# EasyEDA Pro project PCB_ExpansionModule_EXISTING_ERRORS.epro

# Schematic Schematic1
Create Date: 2024-09-10; Page Name: P1; Project Name: ESP32拓展板-硬设决赛; Schematic Name: Schematic1; Update Date: 2024-09-10; Company: THU EE; Drawed: Sxz; Page Size: A4; Version: V1.0
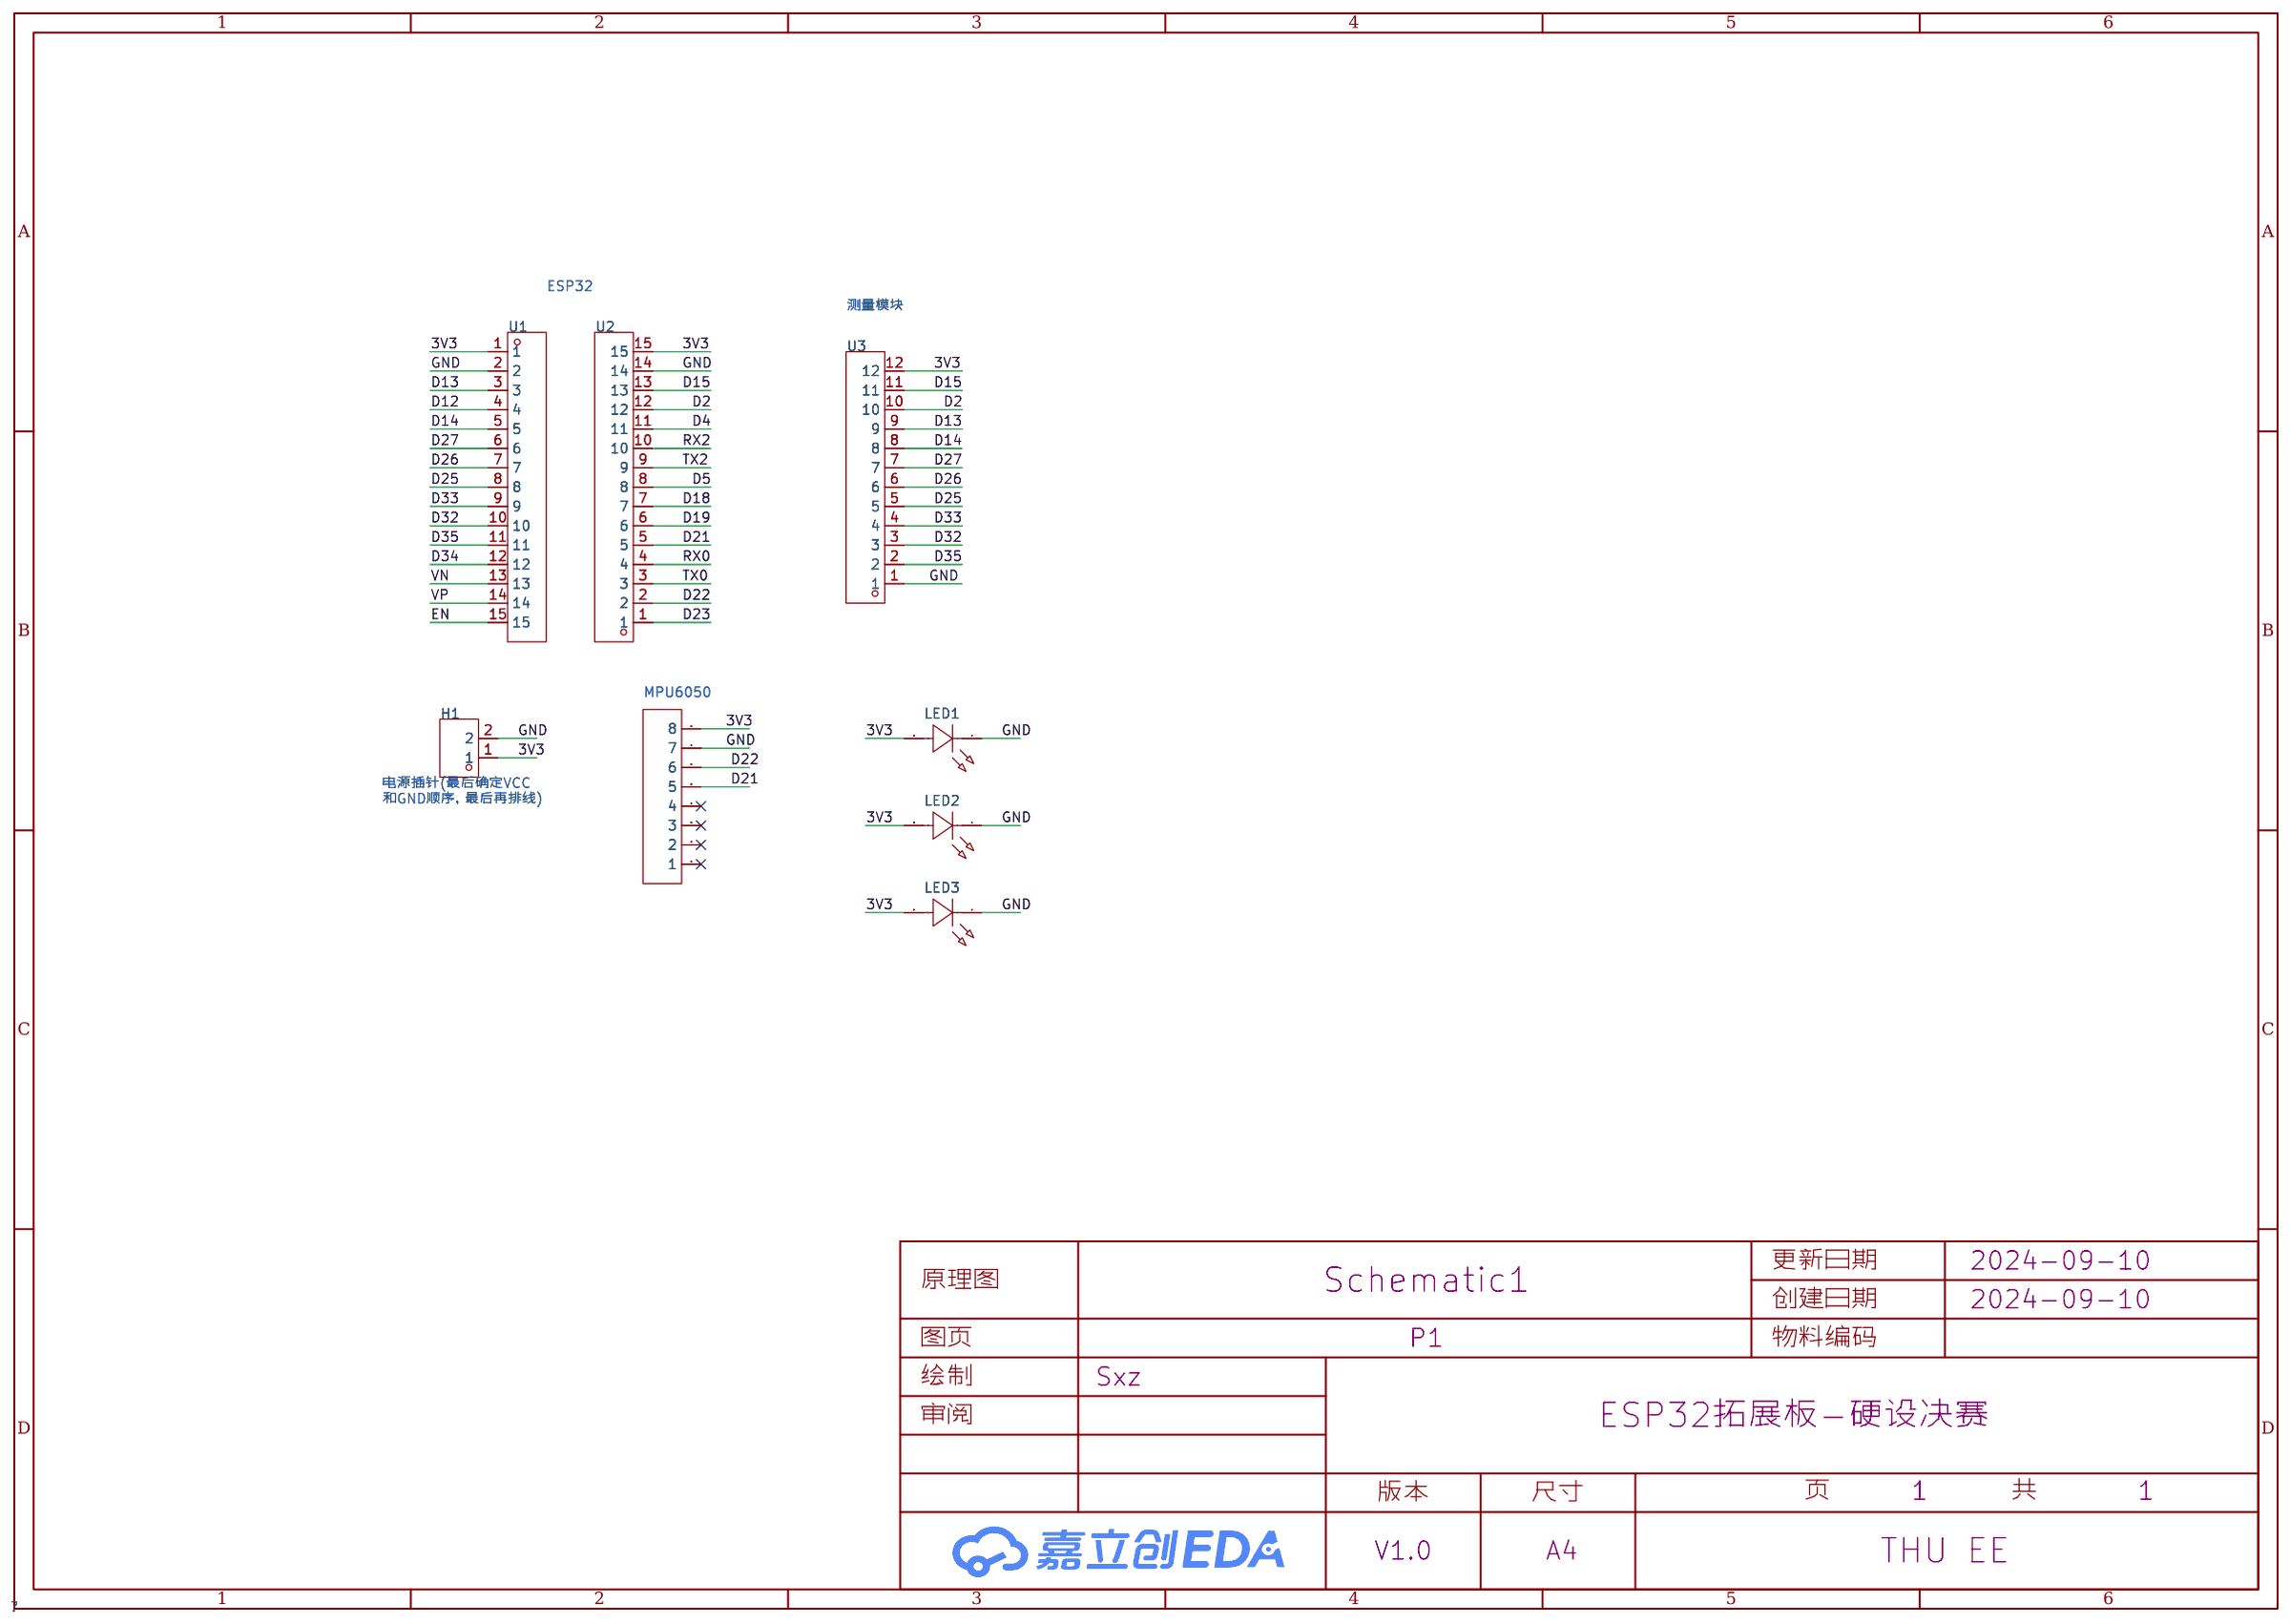
[diagram p0: schematic sheet]

## Parts
H1  -  [HDR-TH_2P-P2.54-H-M-W10.4]
LED1  XL-1608SURC-06  [LED0603-RD_RED]
LED2  XL-1608SURC-06  [LED0603-RD_RED]
LED3  XL-1608SURC-06  [LED0603-RD_RED]
P1  2.54-1*8P母环保  [HDR-TH_8P-P2.54-V-F-1]
U1  KH-2.54FH-1X15P-H8.5  [HDR-TH_15P-P2.54-V-F]
U2  KH-2.54FH-1X15P-H8.5  [HDR-TH_15P-P2.54-V-F]
U3  KH-2.54FH-1X12P-H8.5  [HDR-TH_12P-P2.54-V-F]

## Library data of the parts
H1 = PZ254R-11-02P: 插针结构:1x2P;间距:2.54mm;行距:-;圆针/方针:方针;安装类型:弯插;排数:单排;总PIN位数:2P;额定电流:-;额定电压:-;配合针长度:6mm;塑高:2.5mm;触头材质:黄铜;触头镀层:-;工作温度范围:-40℃~+105℃;颜色:黑色;; LCSC Part Name: 间距:2.54mm 1x2P 弯插 方针; Supplier Part: C492410; Manufacturer: XFCN(兴飞); Supplier Footprint: 弯插,P=2.54mm; JLCPCB Part Class: 扩展库; Datasheet: https://atta.szlcsc.com/upload/public/pdf/source/20200309/C492410_AD20A982E51A4870F6FD4D2413672598.pdf; Supplier: LCSC; Pin Structure: 1x2P; Pitch: 2.54mm; Circluar Pins/Square Pins: 方针; Mounting Type: 弯插; Number of Rows: 单排; Number of Pins: 2P; Length of Mating Pin: 6mm; Insulation Height: 2.5mm; Contact Material: 黄铜; Operating Temperature Range: -40℃~+105℃; Color: 黑色
LED1-LED3 = XL-1608SURC-06: 发光颜色:红色;功率:55mW;正向电流:25mA;主波长:617nm~621nm;透镜颜色:无色透明透镜;色温:-;发光角度:120°;载带方式:正贴;工作温度:-30℃~+85℃;; Supplier Part: C965799; Manufacturer: XINGLIGHT(成兴光); Supplier Footprint: 0603; Datasheet: https://atta.szlcsc.com/upload/public/pdf/source/20221102/D860AFDD1CDB02C5A8064103A32707E2.pdf; Supplier: LCSC; Emitted Color: 红色; Power Dissipation: 55mW; Forward Current: 25mA; Dominant Wavelength: 617nm~621nm; Peak Wavelength: 623nm; Lens Color: 无色透明透镜; Viewing Angle: 120°; Mounting Sytle: 正贴; Operating Temperature: -30℃~+85℃
P1 = 2.54-1*8P母环保: 插孔结构:1x8P;间距:2.54mm;行距:-;安装类型:直插;排数:单排;总孔位数:8P;塑高:-;触头材质:-;触头镀层:-;; LCSC Part Name: 间距:2.54mm 1x8P 直插; Supplier Part: C27438; Manufacturer: BOOMELE(博穆精密); Supplier Footprint: 插件,P=2.54mm; JLCPCB Part Class: 扩展库; Datasheet: https://atta.szlcsc.com/upload/public/pdf/source/20231221/1CA800C6799ED97958773716FAA1BFFE.pdf; Supplier: LCSC; Holes Structure: 1x8P; Pitch: 2.54mm; Mounting Type: 直插; Number of Rows: 单排; Number of Holes: 8P
U1 U2 = KH-2.54FH-1X15P-H8.5: 插孔结构:1x15P;间距:2.54mm;行距:-;圆孔/方孔:方孔;安装类型:直插;排数:单排;总孔位数:15P;额定电流:3A;额定电压:-;插孔方向:顶部;塑高:8.5mm;工作温度范围:-40℃~+105℃;; LCSC Part Name: 间距:2.54mm 1x15P 直插; Supplier Part: C2932676; Manufacturer: kinghelm(金航标); Supplier Footprint: 插件,P=2.54mm; JLCPCB Part Class: 扩展库; Datasheet: https://atta.szlcsc.com/upload/public/pdf/source/20211220/977AA415CFA981E866620A80068F25CA.pdf; Supplier: LCSC; Holes Structure: 1x15P; Pitch: 2.54mm; Circular Hole / Square Hole: 方孔; Mounting Type: 直插; Number of Rows: 单排; Number of Holes: 15P; Current Rating (Max): 3A; Holes Direction: 顶部; Insulation Height: 8.5mm; Operating Temperature Range: -40℃~+105℃
U3 = KH-2.54FH-1X12P-H8.5: 插孔结构:1x12P;间距:2.54mm;行距:-;圆孔/方孔:方孔;安装类型:直插;排数:单排;总孔位数:12P;额定电流:3A;额定电压:-;插孔方向:顶部;塑高:8.5mm;工作温度范围:-40℃~+105℃;; LCSC Part Name: 间距:2.54mm 1x12P 直插; Supplier Part: C2905419; Manufacturer: kinghelm(金航标); Supplier Footprint: 插件,P=2.54mm; JLCPCB Part Class: 扩展库; Datasheet: https://atta.szlcsc.com/upload/public/pdf/source/20211019/641CB8D16C93FF3A6180637CF23C3FAC.pdf; Supplier: LCSC; Holes Structure: 1x12P; Pitch: 2.54mm; Circular Hole / Square Hole: 方孔; Mounting Type: 直插; Number of Rows: 单排; Number of Holes: 12P; Current Rating (Max): 3A; Holes Direction: 顶部; Insulation Height: 8.5mm; Operating Temperature Range: -40℃~+105℃

## Nets
3V3: H1.1 LED1.2(A) LED2.2(A) LED3.2(A) P1.8 U1.1 U2.15 U3.12
GND: H1.2 LED1.1(K) LED2.1(K) LED3.1(K) P1.7 U1.2 U2.14 U3.1
D2: U2.12 U3.10
D4: U2.11
D5: U2.8
D12: U1.4
D13: U1.3 U3.9
D14: U1.5 U3.8
D15: U2.13 U3.11
D18: U2.7
D19: U2.6
D21: P1.5 U2.5
D22: P1.6 U2.2
D23: U2.1
D25: U1.8 U3.5
D26: U1.7 U3.6
D27: U1.6 U3.7
D32: U1.10 U3.3
D33: U1.9 U3.4
D34: U1.12
D35: U1.11 U3.2
EN: U1.15
RX0: U2.4
RX2: U2.10
TX0: U2.3
TX2: U2.9
VN: U1.13
VP: U1.14

Not connected (* = marked no-connect by the designer): P1 1* 2* 3* 4*

## Notes on the sheet
- ESP32
- 测量模块
- MPU6050
- 电源插针(最后确定VCC
  和GND顺序，最后再排线)

# Board PCB1
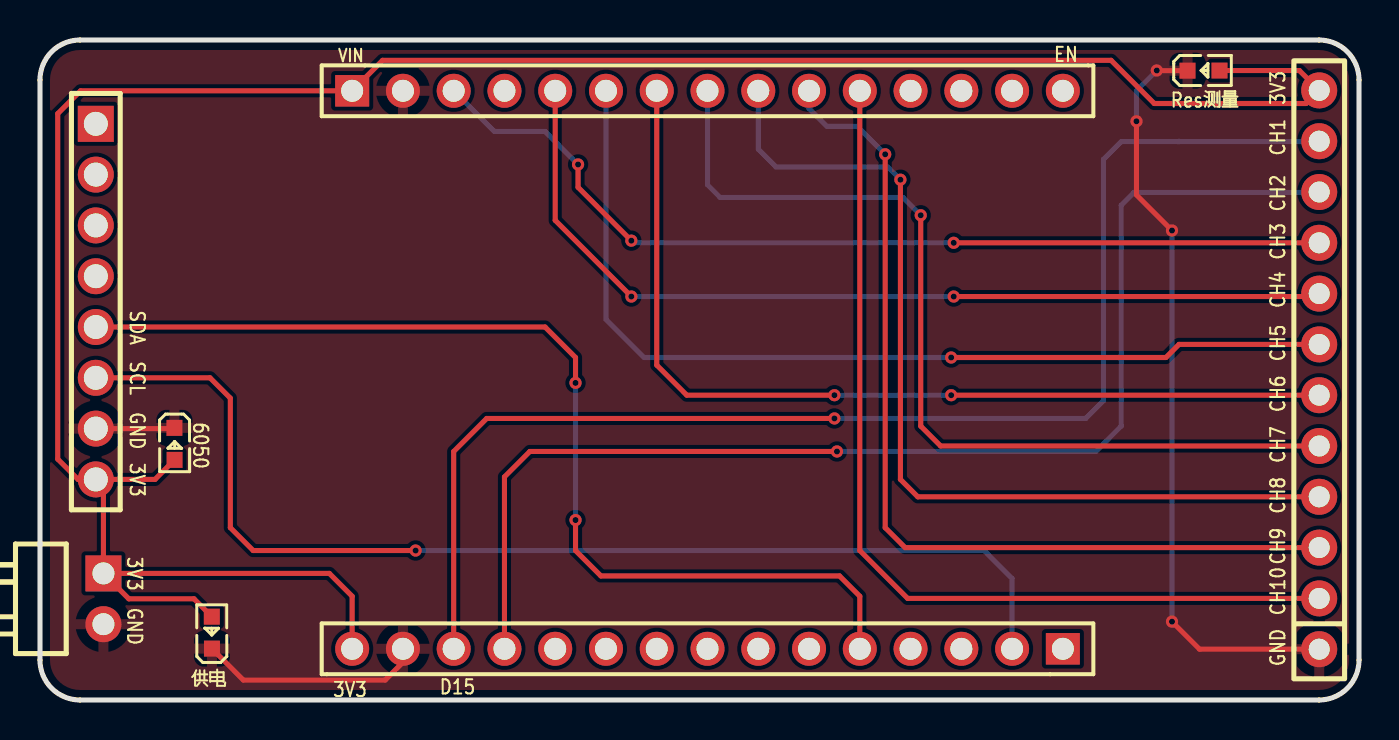
[diagram p1: board, top side]
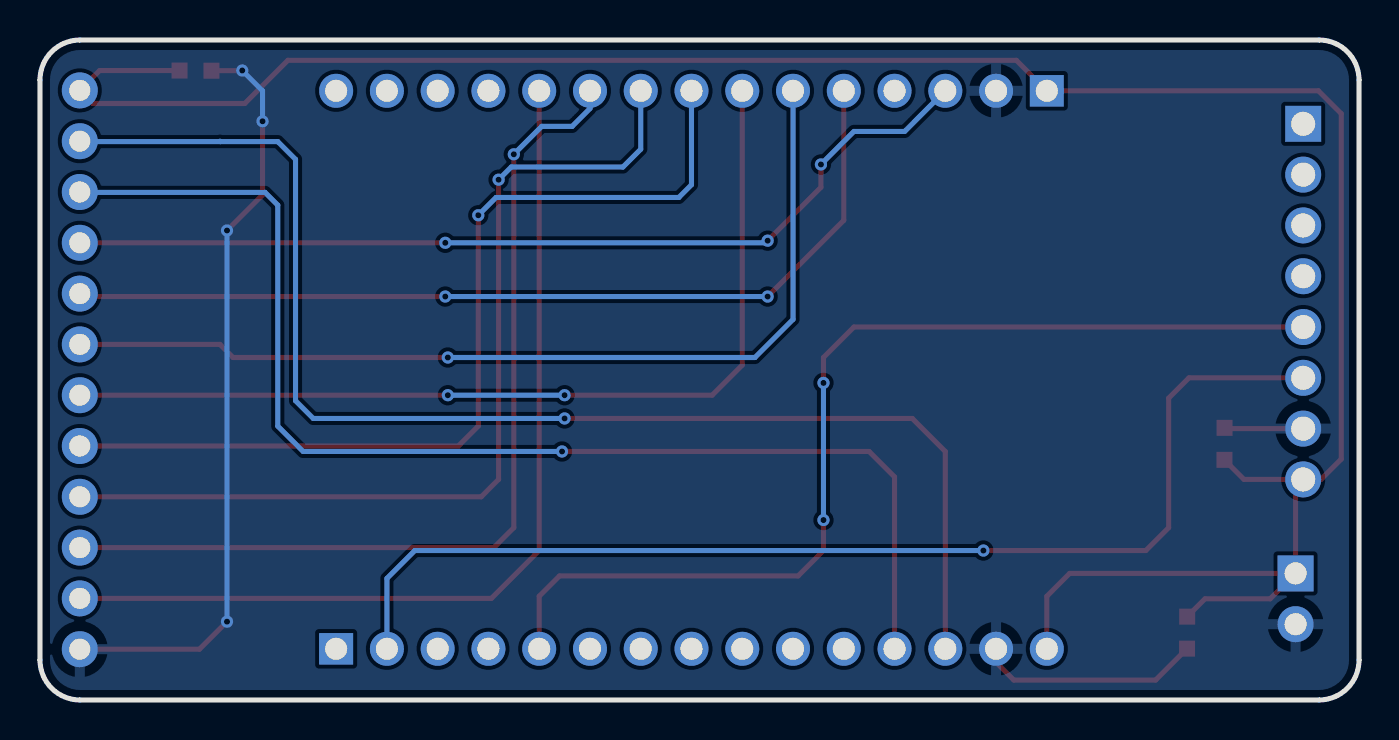
[diagram p2: board, bottom side, seen from below]

Outline 66 x 33 mm; copper layers: Top Layer, Bottom Layer. Coordinates in mm from the lower left corner of the outline.
Outline path: 0,31 0,2 arc(0.59,0.59) 2,0 64,0 arc(65.41,0.59) 66,2 66,31 arc(65.41,32.41) 64,33 2,33 arc(0.59,32.41) 0,31
Stack: Top Layer 0.035mm / Dielectric1 1.51mm FR4 er 4.5 / Bottom Layer 0.035mm

## Design rules (mm)
template: JLCPCB Capability(Two Layers Board)
spacing copperThickness1oz (default): track to track 0.102, other pairs 0.152 to 0.3
spacing copperThickness2oz: track to track 0.203, other pairs 0.152 to 0.3
track width copperThickness1oz (default): min 0.127, default 0.254, max 2.54
track width copperThickness2oz: min 0.203, default 0.254, max 2.54
differential pair differentialPair (default): width min 0.127, default 0.254, max 2.54; gap min 0.152, default 0.152
via viaSize (default): diameter min 0.5, default 0.61, max 10; hole min 0.3, default 0.305, max 6.3

## Placement (name value [footprint] x y rotation side)
H1  -  [HDR-TH_2P-P2.54-H-M-W10.4]  3.17 5.06 270 top
LED1  XL-1608SURC-06  [LED0603-RD_RED]  8.6 3.37 90 top
LED2  XL-1608SURC-06  [LED0603-RD_RED]  58.22 31.47 0 top
LED3  XL-1608SURC-06  [LED0603-RD_RED]  6.73 12.81 270 top
P1  2.54-1*8P母环保  [HDR-TH_8P-P2.54-V-F-1]  2.79 19.92 270 top
U1  KH-2.54FH-1X15P-H8.5  [HDR-TH_15P-P2.54-V-F]  33.4 30.46 0 top
U2  KH-2.54FH-1X15P-H8.5  [HDR-TH_15P-P2.54-V-F]  33.4 2.56 180 top
U3  KH-2.54FH-1X12P-H8.5  [HDR-TH_12P-P2.54-V-F]  64.01 16.51 90 top

## Footprints (pads in the part's own frame, mm; a bottom-side part is the same pattern mirrored in y, then rotated)
HDR-TH_2P-P2.54-H-M-W10.4
  rect 1.8x1.8 hole 1.1: 1(-1.27,0)
  round 1.8 hole 1.1: 2(1.27,0)
HDR-TH_8P-P2.54-V-F-1
  rect 1.8x1.8 hole 1.2: 1(-8.89,0)
  round 1.8 hole 1.2: 2(-6.35,0) 3(-3.81,0) 4(-1.27,0) 5(1.27,0) 6(3.81,0) 7(6.35,0) 8(8.89,0)
HDR-TH_12P-P2.54-V-F
  round 1.8 hole 1.05: 1(-13.97,0) 2(-11.43,0) 3(-8.89,0) 4(-6.35,0) 5(-3.81,0) 6(-1.27,0) 7(1.27,0) 8(3.81,0) 9(6.35,0) 10(8.89,0) 11(11.43,0) 12(13.97,0)
HDR-TH_15P-P2.54-V-F
  rect 1.7x1.575 hole 1.1: 1(-17.78,0)
  round 1.7 hole 1.1: 2(-15.24,0) 3(-12.7,0) 4(-10.16,0) 5(-7.62,0) 6(-5.08,0) 7(-2.54,0) 8(0,0) 9(2.54,0) 10(5.08,0) 11(7.62,0) 12(10.16,0) 13(12.7,0) 14(15.24,0) 15(17.78,0)
LED0603-RD_RED
  rect 0.8x0.8 smd: 1(-0.799,-0.004) 2(0.799,0.004)

## Nets
As in the schematic.

Pads without a net: P1 1 2 3 4

## Via types
v1: diameter 0.61, hole 0.305, Top Layer to Bottom Layer, 20 vias

## Routing (per net, layer and track width the routed paths; a pad name or vN(x,y) marks a point on that pad's centre or on a via; arc(x,y) is an arc through that point)
3V3: length 121.5
  Top Layer w0.254: LED3.2 5.76,11.03 P1.8 ; LED2.2 63.02,31.47 U3.12 63.35,29.82 55.75,29.82 53.59,31.98 17.14,31.98 U1.1 2.03,30.46 0.89,29.32 0.89,12.04 1.91,11.03 P1.8 ; H1.1 3.17,10.65 P1.8 ; H1.1 4.44,5.06 7.71,5.06 LED1.2 ; H1.1 14.48,6.33 15.62,5.19 U2.15
GND: length 53.4
  Top Layer w0.254: U2.14 18.16,1.88 17.27,1 10.18,1 LED1.1 ; U3.1 58.02,2.54 v1(56.64,3.92) ; v1(54.86,28.94) 54.86,25.25 v1(56.64,23.47) ; LED2.1 55.89,31.47 v1(55.88,31.48) ; LED3.1 6.69,13.57 2.79,13.57
  Bottom Layer w0.254: v1(56.64,3.92) v1(56.64,23.47) ; v1(55.88,31.48) 54.86,30.46 v1(54.86,28.94)
D2: length 61.7
  Top Layer w0.254: v1(39.88,12.43) 24.51,12.43 23.24,11.16 U2.12
  Bottom Layer w0.254: v1(39.88,12.43) 52.83,12.43 54.1,13.7 54.1,24.74 54.74,25.38 63.99,25.38 U3.10
D13: length 47.1
  Top Layer w0.254: v1(26.92,26.78) 26.92,25.63 v1(29.59,22.97) ; U3.9 v1(45.72,22.86)
  Bottom Layer w0.254: v1(26.92,26.78) 25.27,28.43 22.73,28.43 U1.3 ; v1(29.59,22.97) 29.7,22.86 v1(45.72,22.86)
D14: length 46.3
  Top Layer w0.254: U3.8 63.86,20.17 v1(45.72,20.17) ; v1(29.59,20.17) 25.78,23.98 U1.5
  Bottom Layer w0.254: v1(45.72,20.17) v1(29.59,20.17)
D15: length 66.7
  Top Layer w0.254: v1(39.75,14.08) 22.35,14.08 20.7,12.43 U2.13
  Bottom Layer w0.254: 56.97,27.92 56.99,27.94 ; 56.97,27.92 54.1,27.92 53.21,27.03 53.21,14.97 52.32,14.08 v1(39.75,14.08) ; 56.97,27.92 63.99,27.92 U3.11
D21: length 52.1
  Top Layer w0.254: v1(26.8,9) 26.8,7.47 28.07,6.2 40.01,6.2 41.02,5.19 U2.5 ; P1.5 25.27,18.65 26.8,17.12 v1(26.8,15.85)
  Bottom Layer w0.254: v1(26.8,15.85) v1(26.8,9)
D22: length 57.3
  Top Layer w0.254: v1(18.8,7.47) 10.67,7.47 9.52,8.62 9.52,15.09 8.51,16.11 P1.6
  Bottom Layer w0.254: U2.2 48.64,6.08 47.24,7.47 v1(18.8,7.47)
D25: length 46.9
  Top Layer w0.254: U3.5 45.06,12.7 44.07,13.7 v1(44.07,24.24)
  Bottom Layer w0.254: U1.8 33.4,25.76 34.04,25.13 43.18,25.13 v1(44.07,24.24)
D26: length 47.5
  Top Layer w0.254: U1.7 30.86,16.74 32.36,15.24 v1(39.75,15.24) ; U3.6 v1(45.59,15.24)
  Bottom Layer w0.254: v1(45.59,15.24) v1(39.75,15.24)
D27: length 48.2
  Top Layer w0.254: U3.7 56.99,17.78 56.34,17.12 v1(45.59,17.12)
  Bottom Layer w0.254: v1(45.59,17.12) 30.23,17.12 28.32,19.03 U1.6
D32: length 46.4
  Top Layer w0.254: U3.3 43.29,7.62 42.29,8.62 v1(42.29,27.28)
  Bottom Layer w0.254: U1.10 38.48,29.57 39.37,28.68 40.89,28.68 v1(42.29,27.28)
D33: length 47
  Top Layer w0.254: U3.4 43.92,10.16 43.05,11.03 v1(43.05,26.02)
  Bottom Layer w0.254: v1(43.05,26.02) 42.42,26.65 36.83,26.65 35.94,27.54 U1.9
D35: length 47
  Top Layer w0.254: U1.11 41.02,7.47 43.41,5.08 U3.2

## Copper pours and planes (outline as drawn; the poured copper is in the pictures)
GND on Top Layer: -16.38,44.18 75.06,44.18 75.06,-14.37 -16.38,-14.37
GND on Bottom Layer: -23.24,50.53 82.8,50.53 82.8,-23.26 -23.24,-23.26

## Text on the board
Top Silkscreen Layer: VIN | 3V3 | D15 | EN | CH1 | CH2 | CH3 | CH4 | CH5 | CH6 | CH7 | CH8 | CH10 | GND | 6050 | CH9 | SCL | SDA | 供电 | Res测量
